# Altium schematic sheet JTAG.SchDoc: FIT_PM12 board
size 420 x 297 mm; CheckedBy: G.Kasprowicz; Author: INR Moscow; CompanyName: WUT ISE; DrawnBy: M.Podgórski; Organization: WUT ISE; Address1: PW ISE; Address2: Nowowiejska 15/19 00-665 Warsaw; Address3: gkasprow@gmail.com; DocumentNumber: 25; Revision: 2; SheetNumber: 23; SheetTotal: 34; ModifiedBy: -; CheckedDate: -; Title2: JTAG; DivGrp: WUT ISE; Designer: INR RAS; ModifiedDate: -; ProjectName: Sensor Box
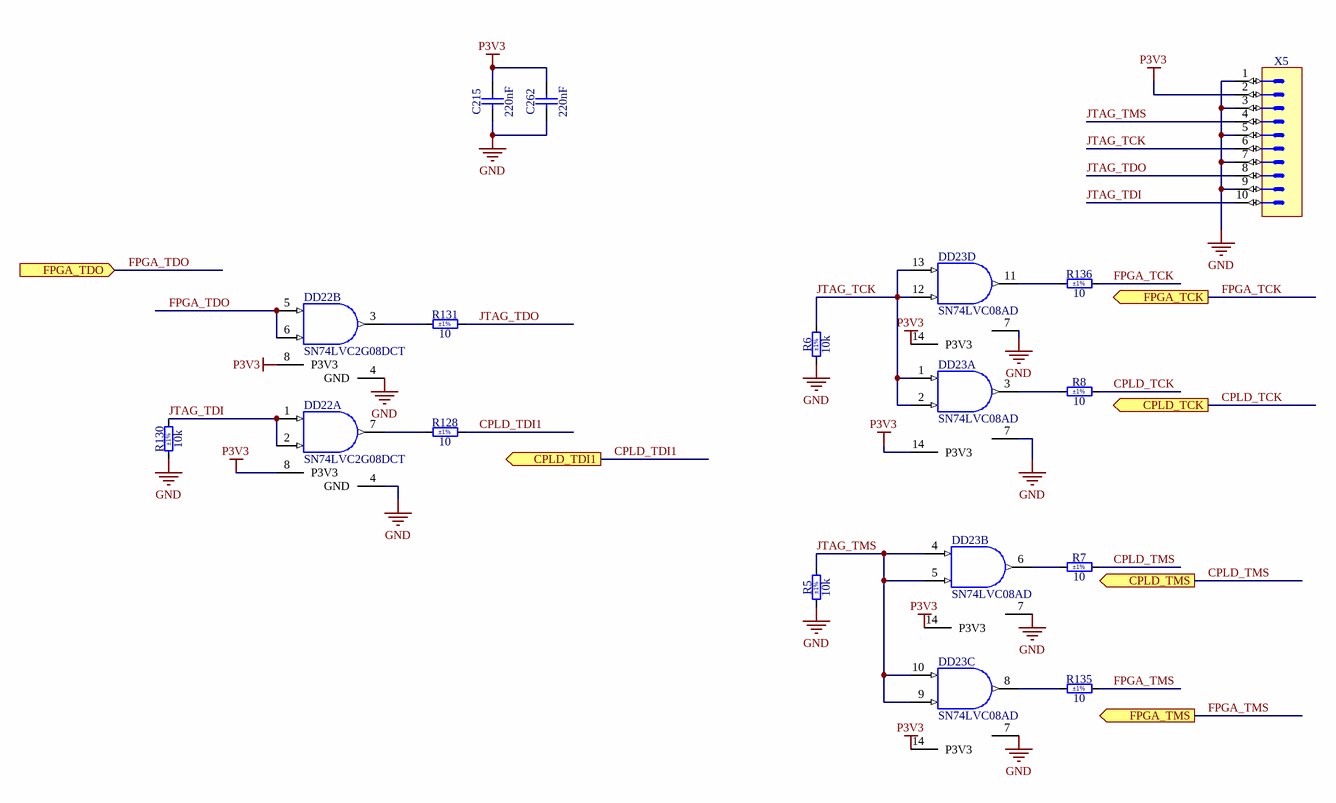
[diagram p0: JTAG.SchDoc]

## Parts
C215  220nF  [CAPC2012X135N]
C262  220nF  [CAPC2012X135N]
DD22  SN74LVC2G08DCT  [SOP65P400X130-8N]  (parts A,B of 2)
DD23  SN74LVC08AD  [SOIC127P600X175-14N]  (parts A,B,C,D of 4)
R5  10k  Tolerance: ±1%  [RESC2012X60N]
R6  10k  Tolerance: ±1%  [RESC2012X60N]
R7  10  Tolerance: ±1%  [RESC2012X70N]
R8  10  Tolerance: ±1%  [RESC2012X70N]
R128  10  Tolerance: ±1%  [RESC2012X70N]
R130  10k  Tolerance: ±1%  [RESC2012X60N]
R131  10  Tolerance: ±1%  [RESC2012X70N]
R135  10  Tolerance: ±1%  [RESC2012X70N]
R136  10  Tolerance: ±1%  [RESC2012X70N]
X5  (no value)  [CONNFLY_DS1014-10SF1B-B]

## Ports
CPLD_TCK (out), CPLD_TDI1 (out), CPLD_TMS (out), FPGA_TCK (out), FPGA_TDO (in), FPGA_TMS (out)

## Nets
GND: C215.1 C262.1 DD22.4(GND) DD23.7(GND) R5.1 R6.1 R130.1 X5.1 X5.3 X5.5 X5.7 X5.9
P3V3: C215.2 C262.2 DD22.8(P3V3) DD23.14(P3V3) X5.2  [also labelled VCC]
CPLD_TCK: R8.2 ; port CPLD_TCK
CPLD_TDI1: R128.2 ; port CPLD_TDI1
CPLD_TMS: R7.2 ; port CPLD_TMS
FPGA_TCK: R136.2 ; port FPGA_TCK
FPGA_TDO: DD22.5(A) DD22.6(B) ; port FPGA_TDO
FPGA_TMS: R135.2 ; port FPGA_TMS
JTAG_TCK: DD23.1(A) DD23.2(B) DD23.12(B) DD23.13(A) R6.2 X5.6
JTAG_TDI: DD22.1(A) DD22.2(B) R130.2 X5.10
JTAG_TDO: R131.2 X5.8
JTAG_TMS: DD23.4(A) DD23.5(B) DD23.9(B) DD23.10(A) R5.2 X5.4
NetDD22_3: DD22.3(Y) R131.1
NetDD22_7: DD22.7(Y) R128.1
NetDD23_3: DD23.3(Y) R8.1
NetDD23_6: DD23.6(Y) R7.1
NetDD23_8: DD23.8(Y) R135.1
NetDD23_11: DD23.11(Y) R136.1

## Notes on the sheet
- Project/Equipment
- Document
- Designer
- Drawn by
- Check.by
- Copyright WUT ISE 2024.
  This documentation describes Open Hardware and is licensed under the CERN OHL v.2. You may redistribute and modify this documentation under the terms of the CERN OHL v.2. (http://ohwr.org/CERNOHL). This documentation is distributed WITHOUT ANY EXPRESS OR IMPLIED WARRANTY, INCLUDING OF MERCHANTABILITY, SATISFACTORY QUALITY AND FITNESS FOR A PARTICULAR PURPOSE. Please see the CERN OHL v.2 for applicable conditions.
- Contact
- File
- Last Mod.
- Print Date
- Sheet
- Size
- A3
- of
- Rev

## Library data of the parts
C215 C262 = CC0805_220NF_50V_10%_X7R: Non-polarised capacitor; Part Description: SMD Multilayer Chip Ceramic Capacitor; Manufacturer: GENERIC; Manufacturer1 Part Number: GRM21BR71H224KA01L; Voltage: 50V; TC: X7R; Tolerance: ±10%; Part Number: CC0805_220NF_50V_10%_X7R; Component Kind: Standard; Component Type: Standard; Pin Count: 2; Value: 220nF; Status: Preferred; Manufacturer Part Number: CC0805_220NF_50V_10%_X7R; Case: 0805; Mounted: Yes; Socket: No; SMD: Yes; Sense: No; Manufacturer1 Example: MURATA; Manufacturer1 ComponentHeight: 1.35mm; HelpURL: \\cern.ch\dfs\Applications\Altium\Datasheets\CC0805_X7R_MURATA.pdf; Author: CERN DEM JLC; CreateDate: 03.12.2007; LatestRevisionDate: 03.12.2007
DD22 = SN74LVC2G08DCT: Dual 2-Input Positive AND Gate; Part Description: Dual 2-Input Positive-AND Gate; Manufacturer: TEXAS INSTRUMENTS; PressFit: No; Bonding: No; Part Number: SN74LVC2G08DCT; Component Kind: Standard; Component Type: Standard; Device: SN74LVC2G08DCT; PackageDescription: SOP, 0.65mm Pitch; 8 Pin, 2.80mm W X 2.95mm L X 1.30mm H body, IPC Medium Density; Manufacturer Part Number: SN74LVC2G08DCT; Pin Count: 8; Case: TSSOP8; Mounted: Yes; Socket: No; SMD: Yes; Sense: No; ComponentHeight: 1.3mm; Author: CERN DEM MR; HelpURL: \\cern.ch\dfs\Applications\Altium\Datasheets\SN74LVC2G08DCT.pdf; CreateDate: 10.03.2017; LatestRevisionDate: 10.03.2017
DD23 = SN74LVC08AD: Quad 2-Input AND Gate; Part Description: Quadruple 2-Input Positive-AND Gate; Manufacturer: TEXAS INSTRUMENTS; PressFit: No; Bonding: No; Part Number: SN74LVC08AD; Component Kind: Standard; Component Type: Standard; Device: SN74LVC08AD; PackageDescription: SOIC 14, Pitch 1.27mm - Body 4x8.75mm, IPC Medium Density; Manufacturer Part Number: SN74LVC08AD; Pin Count: 14; Case: SOIC14; Mounted: Yes; Socket: No; SMD: Yes; Sense: No; ComponentHeight: 1.75mm; Author: CERN DEM JLC; HelpURL: \\cern.ch\dfs\Applications\Altium\Datasheets\SN74LVC08AD.pdf; CreateDate: 21.03.2012; LatestRevisionDate: 21.03.2012
R5 R6 R130 = R0805_10K_1%_0.125W_100PPM: Resistor - 1%; Part Description: General Purpose Thick Film Chip Resistor; Manufacturer: GENERIC; Manufacturer1 Part Number: NRC10F1002TRF; Power: 0.125W; TC: ±100ppm/°C; PressFit: No; Part Number: R0805_10K_1%_0.125W_100PPM; Component Kind: Standard; Component Type: Standard; Pin Count: 2; Value: 10k; Status: Preferred; Manufacturer Part Number: R0805_10K_1%_0.125W_100PPM; Case: 0805; Mounted: Yes; Sense: No; Socket: No; SMD: Yes; Manufacturer1 Example: NIC COMPONENT; Manufacturer1 ComponentHeight: 0.6mm; HelpURL: \\cern.ch\dfs\Applications\Altium\Datasheets\R0805_NIC_NRC.pdf; Author: CERN DEM JLC; CreateDate: 03.12.2007; LatestRevisionDate: 13.03.2008
R7 R8 R128 R131 R135 R136 = R0805_10R_1%_0.125W_100PPM_PANASONIC_ERJ: Resistor - 1%; Part Description: Low Resistance Thick Film Chip Resistor; Manufacturer Part Number: ERJ6ENF10R0V; Power: 0.125W; TC: ±100ppm/°C; PressFit: No; Part Number: R0805_10R_1%_0.125W_100PPM_PANASONIC_ERJ; Component Kind: Standard; Component Type: Standard; Pin Count: 2; Value: 10; Status: None; Manufacturer: PANASONIC; Case: 0805; Mounted: Yes; Sense: No; Socket: No; SMD: Yes; ComponentHeight: 0.7mm; HelpURL: \\cern.ch\dfs\Applications\Altium\Datasheets\R0805_PANASONIC_ERJ6EN.pdf; Author: CERN DEM HF; CreateDate: 07.06.2024; LatestRevisionDate: 07.06.2024
X5 = CONNFLY_DS1014-10SF1B-B: Connector 10 Male; Part Description: 10 Contacts, 2.00mm Box Header V/T,R/A & SMT Type; PressFit: No; Part Number: CONNFLY_DS1014-10SF1B-B; Component Kind: Standard; Component Type: Standard; Pin Count: 10; Mounted: Yes; Socket: No; SMD: No; Sense: No; Status: None; Manufacturer: CONNFLY; Manufacturer Part Number: DS1014-10SF1B-B; ComponentHeight: 5.6mm; HelpURL: \\cern.ch\dfs\Applications\Altium\Datasheets\CONNFLY_DS1014-10SF1B-B.pdf; Author: CERN DEM HF; CreateDate: 29.05.2024; LatestRevisionDate: 29.05.2024